# EAGLE design rpi4pcie (EAGLE 9.6.1)
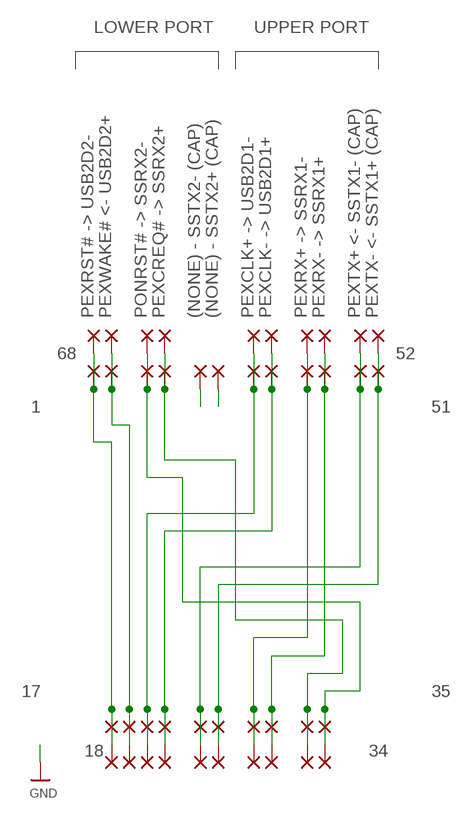
[diagram p0: schematic, sheet 1]

## Parts
PAD19  PADQFN-0.4  [PAD-QFN-0.4]
PAD20  PADQFN-0.4  [PAD-QFN-0.4]
PAD21  PADQFN-0.4  [PAD-QFN-0.4]
PAD22  PADQFN-0.4  [PAD-QFN-0.4]
PAD24  PADQFN-0.4  [PAD-QFN-0.4]
PAD25  PADQFN-0.4  [PAD-QFN-0.4]
PAD27  PADQFN-0.4  [PAD-QFN-0.4]
PAD28  PADQFN-0.4  [PAD-QFN-0.4]
PAD30  PADQFN-0.4  [PAD-QFN-0.4]
PAD31  PADQFN-0.4  [PAD-QFN-0.4]
PAD52  PADQFN-0.4  [PAD-QFN-0.4]
PAD53  PADQFN-0.4  [PAD-QFN-0.4]
PAD55  PADQFN-0.4  [PAD-QFN-0.4]
PAD56  PADQFN-0.4  [PAD-QFN-0.4]
PAD58  PADQFN-0.4  [PAD-QFN-0.4]
PAD59  PADQFN-0.4  [PAD-QFN-0.4]
PAD61  PADQFN-0.4  [PAD-QFN-0.4]
PAD62  PADQFN-0.4  [PAD-QFN-0.4]
PAD64  PADQFN-0.4  [PAD-QFN-0.4]
PAD65  PADQFN-0.4  [PAD-QFN-0.4]
PAD67  PADQFN-0.4  [PAD-QFN-0.4]
PAD68  PADQFN-0.4  [PAD-QFN-0.4]
PAD69  PADQFN-0.4  [PAD-QFN-0.4]
PAD70  PADQFN-0.4  [PAD-QFN-0.4]
PAD71  PADQFN-0.4  [PAD-QFN-0.4]
PAD72  PADQFN-0.4  [PAD-QFN-0.4]
PAD73  PADQFN-0.4  [PAD-QFN-0.4]
PAD74  PADQFN-0.4  [PAD-QFN-0.4]
PAD75  PADQFN-0.4  [PAD-QFN-0.4]
PAD76  PADQFN-0.4  [PAD-QFN-0.4]
PAD77  PADQFN-0.4  [PAD-QFN-0.4]
PAD78  PADQFN-0.4  [PAD-QFN-0.4]
PAD79  PADQFN-0.4  [PAD-QFN-0.4]
PAD80  PADQFN-0.4  [PAD-QFN-0.4]
PAD81  PADQFN-0.4  [PAD-QFN-0.4]
PAD82  PADQFN-0.4  [PAD-QFN-0.4]
PAD83  PADQFN-0.4  [PAD-QFN-0.4]
PAD84  PADQFN-0.4  [PAD-QFN-0.4]
PAD85  PADQFN-0.4  [PAD-QFN-0.4]
PAD86  PADQFN-0.4  [PAD-QFN-0.4]
PAD87  PADQFN-0.4  [PAD-QFN-0.4]
PAD88  PADQFN-0.4  [PAD-QFN-0.4]

## Nets
N$1: PAD19.1 PAD68.1 PAD69.1 PAD77.1
N$2: PAD20.1 PAD67.1 PAD70.1 PAD78.1
N$3: PAD21.1 PAD59.1 PAD71.1 PAD79.1
N$4: PAD22.1 PAD58.1 PAD72.1 PAD80.1
N$5: PAD25.1 PAD52.1 PAD76.1 PAD82.1
N$6: PAD31.1 PAD65.1 PAD86.1 PAD87.1
N$7: PAD27.1 PAD56.1 PAD73.1 PAD83.1
N$8: PAD28.1 PAD55.1 PAD74.1 PAD84.1
N$9: PAD24.1 PAD53.1 PAD75.1 PAD81.1
N$10: PAD30.1 PAD64.1 PAD85.1 PAD88.1
N$11: PAD61.1
N$12: PAD62.1

## Notes on the sheet
- LOWER PORT | UPPER PORT
- PEXRST# -> USB2D2- | PEXWAKE# <- USB2D2+ | PONRST# -> SSRX2- | PEXCREQ# -> SSRX2+ | (NONE) - SSTX2- (CAP) | (NONE) - SSTX2+ (CAP) | PEXCLK+ -> USB2D1- | PEXCLK- -> USB2D1+ | PEXRX+ -> SSRX1- | PEXRX- -> SSRX1+ | PEXTX+ <- SSTX1- (CAP) | PEXTX- <- SSTX1+ (CAP)
- 68 | 52
- 1 | 51
- 17 | 35
- 18 | 34

## Library data of the parts
PAD19-PAD22 PAD24 PAD25 PAD27 PAD28 PAD30 PAD31 PAD52 PAD53 PAD55 PAD56 PAD58 PAD59 PAD61 PAD62 PAD64 PAD65 PAD67-PAD88 = zak:PAD

## Board
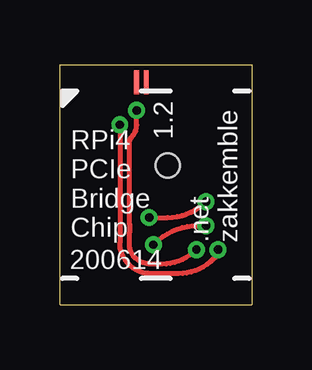
[diagram p1: board, top side]
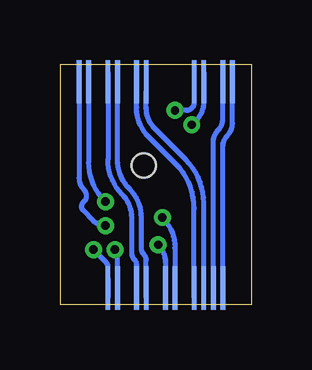
[diagram p2: board, bottom side, seen from below]

Size 8 x 10 mm. Coordinates in mm from the lower left corner, seen from the top.
Outline: 0,0 0,10 8,10 8,0 0,0
Copper layers (1*16): Top 0.0356mm / dielectric 1.5011mm / Bottom 0.0356mm
Design rules "LaenPCBOrder *": minimum track width 6mil, minimum drill 13mil, track to track 6mil, track to pad 6mil, pad to pad 6mil, via to via 6mil, smd to smd 6mil, copper to edge 15mil, drill to drill 6mil, minimum pad ring 11mil, minimum via ring 7mil, stop-mask expansion 2.5mil, vias tented up to drill 24mil, thermal gap 10mil
Holes 1 mm at 4.5,5.8

### Footprints (pad centres in the part's own frame; a part is rotated, then mirrored left to right if it is on the bottom)
PAD-QFN-0.4 = smd 0.2 x 1: 1 0,0

### Placement (x,y rotation side)
PAD19  1.2,1.1 0 bottom
PAD20  1.6,1.1 0 bottom
PAD21  2,1.1 0 bottom
PAD22  2.4,1.1 0 bottom
PAD24  3.2,1.1 0 bottom
PAD25  3.6,1.1 0 bottom
PAD27  4.4,1.1 0 bottom
PAD28  4.8,1.1 0 bottom
PAD30  5.6,1.1 0 bottom
PAD31  6,1.1 0 bottom
PAD52  7.2,8.9 0 bottom
PAD53  6.8,8.9 0 bottom
PAD55  6,8.9 0 bottom
PAD56  5.6,8.9 0 bottom
PAD58  4.8,8.9 0 bottom
PAD59  4.4,8.9 0 bottom
PAD61  3.6,9.27 0 top
PAD62  3.2,9.27 0 top
PAD64  2.4,8.9 0 bottom
PAD65  2,8.9 0 bottom
PAD67  1.2,8.9 0 bottom
PAD68  0.8,8.9 0 bottom
PAD69  0.8,9.7 0 bottom
PAD70  1.2,9.7 0 bottom
PAD71  4.4,9.7 0 bottom
PAD72  4.8,9.7 0 bottom
PAD73  5.6,9.7 0 bottom
PAD74  6,9.7 0 bottom
PAD75  6.8,9.7 0 bottom
PAD76  7.2,9.7 0 bottom
PAD77  1.2,0.3 0 bottom
PAD78  1.6,0.3 0 bottom
PAD79  2,0.3 0 bottom
PAD80  2.4,0.3 0 bottom
PAD81  3.2,0.3 0 bottom
PAD82  3.6,0.3 0 bottom
PAD83  4.4,0.3 0 bottom
PAD84  4.8,0.3 0 bottom
PAD85  5.6,0.3 0 bottom
PAD86  6,0.3 0 bottom
PAD87  2,9.7 0 bottom
PAD88  2.4,9.7 0 bottom

### Tracks (layer width: path | path; a pad name or v marks a point on that pad's centre or on a via)
N$1
  Bottom 0.2: PAD69.1 PAD68.1 0.8,7.55 arc45 1,7.07 arc-45 1.2,6.59 PAD19.1 PAD77.1
N$2
  Bottom 0.2: PAD70.1 PAD67.1 1.2,7.75 arc45 1.4,7.27 arc-45 1.6,6.79 PAD20.1 PAD78.1
N$3
  Bottom 0.2: PAD71.1 PAD59.1 4.4,8.21 arc-45 4.04,7.34 2.74,6.04 arc45 2,4.25 PAD21.1 PAD79.1
N$4
  Bottom 0.2: PAD72.1 PAD58.1 4.8,8.21 arc-45 4.3,7 3.14,5.84 arc45 2.4,4.05 2.4,4 PAD22.1 PAD80.1
N$5  (via drill 0.35)
  Top 0.2: v3.9,2.5 3.96,2.56 arc-45 5.75,3.3 v6.1,3.3
  Bottom 0.2: v3.9,2.5 arc45 3.6,1.78 PAD25.1 PAD82.1 | v6.1,3.3 arc45 6.61,3.51 7.03,3.93 arc45 7.1,4.1 arc45 7.03,4.27 6.97,4.33 arc-45 6.9,4.5 6.9,4.56 arc-45 7,4.8 arc45 7.2,5.28 PAD52.1 PAD76.1
N$6  (via drill 0.35)
  Top 0.2: v6.6,2.3 arc-45 6.46,1.96 6.41,1.91 arc-45 4.93,1.3 3.8,1.3 arc-45 2.87,1.68 arc-45 2.5,2.58 v2.5,7.5
  Bottom 0.2: v2.5,7.5 2.31,7.69 arc-45 2,8.44 PAD65.1 PAD87.1 | v6.6,2.3 6.07,1.77 arc45 6,1.6 PAD31.1 PAD86.1
N$7
  Bottom 0.2: PAD73.1 PAD56.1 5.6,6.06 arc-45 5.08,4.81 arc45 4.6,3.65 4.6,2.34 arc-45 4.5,2.1 arc45 4.4,1.86 PAD27.1 PAD83.1
N$8
  Bottom 0.2: PAD74.1 PAD55.1 6,6.05 arc-45 5.4,4.6 arc45 5,3.63 5,2.14 arc-45 4.9,1.9 arc45 4.8,1.66 PAD28.1 PAD84.1
N$9  (via drill 0.35)
  Top 0.2: v3.72,3.64 4.5,3.64 arc45 v6.1,4.3
  Bottom 0.2: v6.1,4.3 6.13,4.33 arc45 6.8,5.95 PAD53.1 PAD75.1 | v3.72,3.64 arc45 3.2,2.38 PAD24.1 PAD81.1
N$10  (via drill 0.35)
  Top 0.2: v5.7,2.3 arc-45 4.25,1.7 3.8,1.7 arc-45 3.12,1.98 3.1,2 arc-45 2.9,2.48 2.9,3 2.9,3.38 2.9,6.76 arc-45 3,7 arc45 3.2,7.48 v3.2,8.1
  Bottom 0.2: 2.7,8.1 arc-45 2.53,8.17 2.47,8.23 arc-45 2.4,8.4 PAD64.1 PAD88.1 | 2.7,8.1 arc-45 2.7,8.1 | 2.7,8.1 v3.2,8.1 | v5.7,2.3 arc45 5.6,2.06 PAD30.1 PAD85.1

### Text on the board
tPlace: 1.2 | RPi4 / PCIe / Bridge / Chip | .net / zakkemble | 200614